# Altium project APEX.PrjPcb
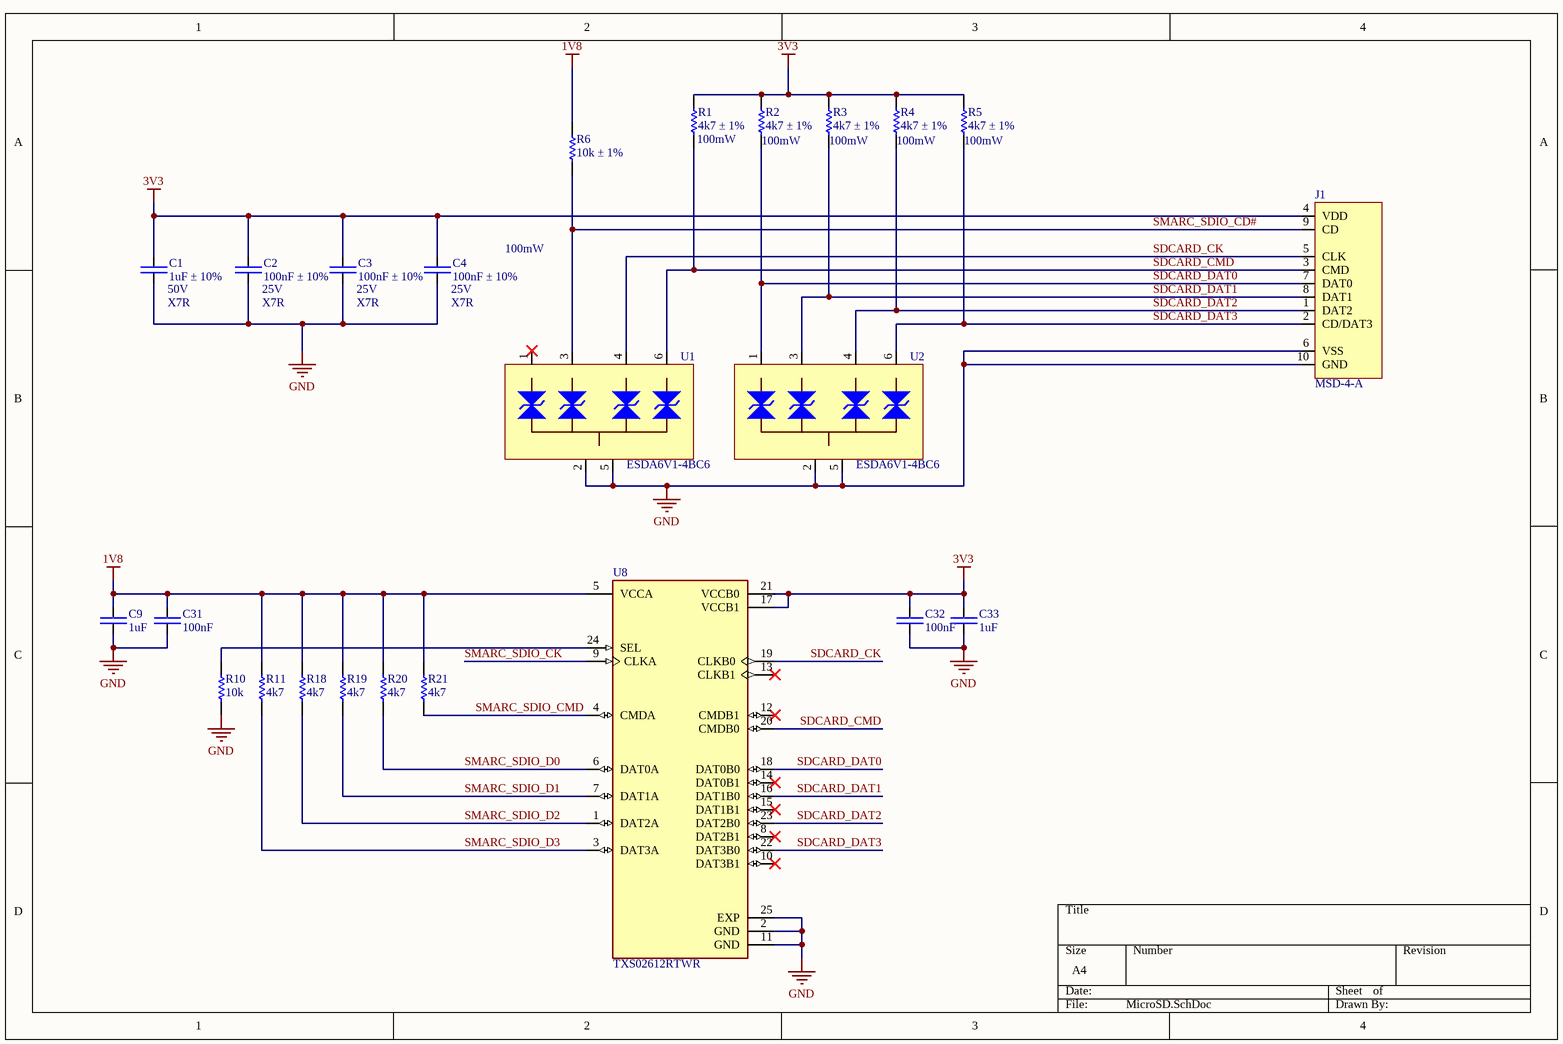
[diagram p0: MicroSD.SchDoc]
12 sheets, 103 parts. Net scope: global (net labels, ports and power ports of the same name join across sheets).
Board file: PCB.PcbDoc
Sheets:
  MicroSD.SchDoc
  Power.SchDoc
  Ethernet.SchDoc
  CAN.SchDoc
  USB.SchDoc
  Headers.SchDoc
  LEDs.SchDoc
  Display.SchDoc
  SMARC Pinout-1.SchDoc
  SMARC Pinout-2.SchDoc
  SMARC Pinout-3.SchDoc
  UART Debug.SchDoc

## Sheet MicroSD.SchDoc
size A4; SheetNumber: 1; SheetTotal: 3

### Parts
C1  1uF ± 10%  [CAP-0805]
C2  100nF ± 10%  [CAP-0603]
C3  100nF ± 10%  [CAP-0603]
C4  100nF ± 10%  [CAP-0603]
C9  1uF  [CAP-0805]
C31  100nF  [CAP-0603]
C32  100nF  [CAP-0603]
C33  1uF  [CAP-0805]
J1  MSD-4-A  [MSD-4-A]
R1  4k7 ± 1%  [RES-0603]
R2  4k7 ± 1%  [RES-0603]
R3  4k7 ± 1%  [RES-0603]
R4  4k7 ± 1%  [RES-0603]
R5  4k7 ± 1%  [RES-0603]
R6  10k ± 1%  [RES-0603]
R10  10k  [RES-0603]
R11  4k7  [RES-0603]
R18  4k7  [RES-0603]
R19  4k7  [RES-0603]
R20  4k7  [RES-0603]
R21  4k7  [RES-0603]
U1  ESDA6V1-4BC6  [ESDA6V1-4BC6]
U2  ESDA6V1-4BC6  [ESDA6V1-4BC6]
U8  TXS02612RTWR  [TXS02612RTWR]

### Nets
1V8: C9.2 C31.2 R6.2 R11.2 R18.2 R19.2 R20.2 R21.2 U8.5(VCCA)
3V3: C1.2 C2.2 C3.2 C4.2 C32.2 C33.2 J1.4(VDD) R1.2 R2.2 R3.2 R4.2 R5.2 U8.17(VCCB1) U8.21(VCCB0)
GND: C1.1 C2.1 C3.1 C4.1 C9.1 C31.1 C32.1 C33.1 J1.6(VSS) J1.10(GND) R10.1 U1.2 U1.5 U2.2 U2.5 U8.2(GND) U8.11(GND) U8.25(EXP)
SDCARD_CK: J1.5(CLK) U1.4 U8.19(CLKB0)
SDCARD_CMD: J1.3(CMD) R1.1 U1.6 U8.20(CMDB0)
SDCARD_DAT0: J1.7(DAT0) R2.1 U2.1 U8.18(DAT0B0)
SDCARD_DAT1: J1.8(DAT1) R3.1 U2.3 U8.16(DAT1B0)
SDCARD_DAT2: J1.1(DAT2) R4.1 U2.4 U8.23(DAT2B0)
SDCARD_DAT3: J1.2(CD/DAT3) R5.1 U2.6 U8.22(DAT3B0)
SMARC_SDIO_CD#: J1.9(CD) R6.1 U1.3
SMARC_SDIO_CK: U8.9(CLKA)
SMARC_SDIO_CMD: R21.1 U8.4(CMDA)
SMARC_SDIO_D0: R20.1 U8.6(DAT0A)
SMARC_SDIO_D1: R19.1 U8.7(DAT1A)
SMARC_SDIO_D2: R18.1 U8.1(DAT2A)
SMARC_SDIO_D3: R11.1 U8.3(DAT3A)
NetR10_2: R10.2 U8.24(SEL)

Not connected (* = marked no-connect by the designer): U1 1*; U8 8(DAT2B1)* 10(DAT3B1)* 12(CMDB1)* 13(CLKB1)* 14(DAT0B1)* 15(DAT1B1)*

### Notes on the sheet
- (near R1) 100mW
- (near R2) 100mW
- (near R3) 100mW
- (near R4) 100mW
- (near R5) 100mW
- 100mW
- (near C1) 50V
- (near C1) X7R
- (near C2) 25V
- (near C2) X7R
- (near C3) 25V
- (near C3) X7R
- (near C4) 25V
- (near C4) X7R

### Library data of the parts
C1 C9 C33 = CAP-0805: Capacitor chip unpolarized. 0805
C2-C4 C31 C32 = CAP-0603: Capacitor chip unpolarized. 0603
J1 = MSD-4-A: Micro SD Connector
R1-R6 R10 R11 R18-R21 = RES-0603: Resistor chip. 0603
U1 U2 = ESDA6V1-4BC6: TVS Diode array 5VRM 7.4VC
U8 = TXS02612RTWR: Voltage Level Translator 24-Pin WQFN EP T/R; MF: Texas Instruments; MP: TXS02612RTWR .; SnapEDA_Link: https://www.snapeda.com/parts/TXS02612RTWR%20./Texas+Instruments/view-part/?ref=snap; Package: None; Value: *; Check_prices: https://www.snapeda.com/parts/TXS02612RTWR%20./Texas+Instruments/view-part/?ref=eda

## Sheet Power.SchDoc
size A4; SheetNumber: 6; SheetTotal: 10
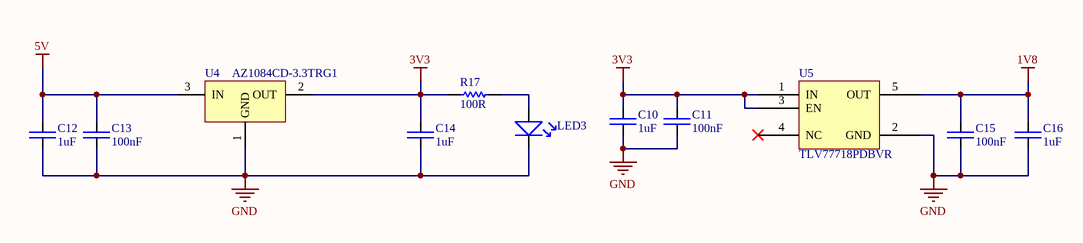
[diagram p1: Power.SchDoc]

### Parts
C10  1uF  [CAP-0805]
C11  100nF  [CAP-0603]
C12  1uF  [CAP-0805]
C13  100nF  [CAP-0603]
C14  1uF  [CAP-0805]
C15  100nF  [CAP-0603]
C16  1uF  [CAP-0805]
LED3  0603 LED  [0603 LED]  (value not drawn)
R17  100R  [RES-0603]
U4  AZ1084CD-3.3TRG1  [AZ1084CD-3.3TRG1]
U5  TLV77718PDBVR  [TLV77718PDBVR]

### Nets
1V8: C15.2 C16.2 U5.5(OUT)
3V3: C10.2 C11.2 C14.2 R17.1 U4.2(OUT) U5.1(IN) U5.3(EN)
5V: C12.2 C13.2 U4.3(IN)
GND: C10.1 C11.1 C12.1 C13.1 C14.1 C15.1 C16.1 LED3.2 U4.1(GND) U5.2(GND)
NetLED3_1: LED3.1 R17.2

Not connected (* = marked no-connect by the designer): U5 4(NC)*

### Library data of the parts
C10 C12 C14 C16 = CAP-0805: Capacitor chip unpolarized. 0805
C11 C13 C15 = CAP-0603: Capacitor chip unpolarized. 0603
R17 = RES-0603: Resistor chip. 0603
U4 = AZ1084CD-3.3TRG1: 3V3 LDO 1A 1.5V Dropout
U5 = TLV77718PDBVR: LDO 1.8V 1A

## Sheet Ethernet.SchDoc
size A4; SheetNumber: 7; SheetTotal: 12
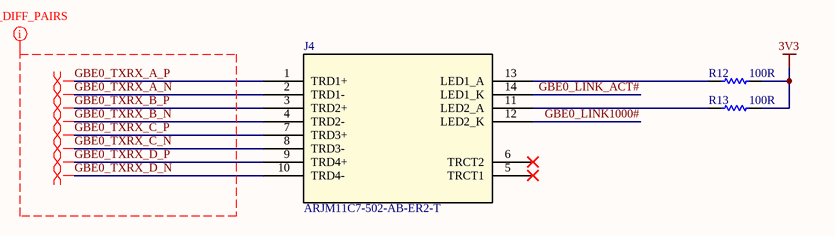
[diagram p2: Ethernet.SchDoc]

### Parts
J4  ARJM11C7-502-AB-ER2-T  [ARJM11C7-502-AB-ER2-T_ABR]
R12  100R  [RES-0603]
R13  100R  [RES-0603]

### Nets
3V3: R12.2 R13.2
GBE0_LINK1000#: J4.12(LED2_K)
GBE0_LINK_ACT#: J4.14(LED1_K)
GBE0_TXRX_A_N: J4.2(TRD1-)
GBE0_TXRX_A_P: J4.1(TRD1+)
GBE0_TXRX_B_N: J4.4(TRD2-)
GBE0_TXRX_B_P: J4.3(TRD2+)
GBE0_TXRX_C_N: J4.8(TRD3-)
GBE0_TXRX_C_P: J4.7(TRD3+)
GBE0_TXRX_D_N: J4.10(TRD4-)
GBE0_TXRX_D_P: J4.9(TRD4+)
NetJ4_11: J4.11(LED2_A) R13.1
NetJ4_13: J4.13(LED1_A) R12.1

Not connected (* = marked no-connect by the designer): J4 5(TRCT1)* 6(TRCT2)*

### Layout directives
differential pair: GBE0_TXRX_A_N, GBE0_TXRX_A_P, GBE0_TXRX_B_N, GBE0_TXRX_B_P, GBE0_TXRX_C_N, GBE0_TXRX_C_P, GBE0_TXRX_D_N, GBE0_TXRX_D_P
net class ETH_DIFF_PAIRS: GBE0_TXRX_A_N, GBE0_TXRX_A_P, GBE0_TXRX_B_N, GBE0_TXRX_B_P, GBE0_TXRX_C_N, GBE0_TXRX_C_P, GBE0_TXRX_D_N, GBE0_TXRX_D_P

### Library data of the parts
J4 = ARJM11C7-502-AB-ER2-T: Ethernet connector with magnetics (1000-T Base); Manufacturer_Name: Abracon; Copyright: Copyright (C) 2025 Ultra Librarian. All rights reserved.; Manufacturer_Part_Number: ARJM11C7-502-AB-ER2-T; RefDes: RefDes; Type: Type
R12 R13 = RES-0603: Resistor chip. 0603

## Sheet CAN.SchDoc
size A4; SheetNumber: 10; SheetTotal: 11
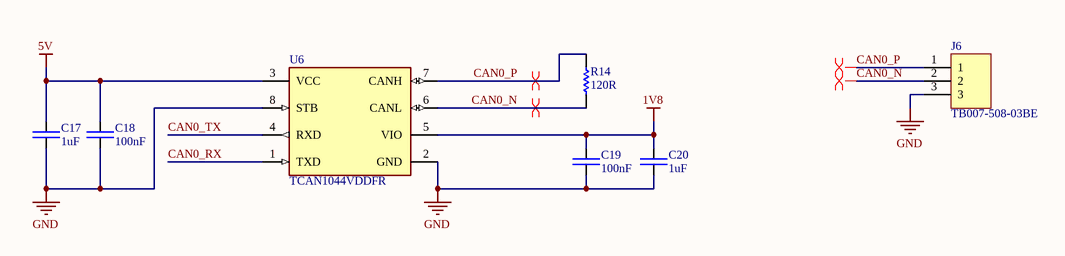
[diagram p3: CAN.SchDoc]

### Parts
C17  1uF  [CAP-0805]
C18  100nF  [CAP-0603]
C19  100nF  [CAP-0603]
C20  1uF  [CAP-0805]
J6  TB007-508-03BE  [CUI_TB007-508-03BE]
R14  120R  [RES-0603]
U6  TCAN1044VDDFR  [FP-DDF0008A-MFG]

### Nets
1V8: C19.2 C20.2 U6.5(VIO)
5V: C17.2 C18.2 U6.3(VCC)
GND: C17.1 C18.1 C19.1 C20.1 J6.3 U6.2(GND) U6.8(STB)
CAN0_N: J6.2 R14.1 U6.6(CANL)
CAN0_P: J6.1 R14.2 U6.7(CANH)
CAN0_RX: U6.1(TXD)
CAN0_TX: U6.4(RXD)

### Layout directives
differential pair: CAN0_N, CAN0_P

### Library data of the parts
C17 C20 = CAP-0805: Capacitor chip unpolarized. 0805
C18 C19 = CAP-0603: Capacitor chip unpolarized. 0603
J6 = TB007-508-03BE: 3 Pos, Screw Type, Horizontal, 5.08 Pitch, 24~12 (AWG), Terminal Block Connector; MF: Same Sky; SnapEDA_Link: https://www.snapeda.com/parts/TB007-508-03BE/Same+Sky/view-part/?ref=snap; Package: None; Value: *; MP: TB007-508-03BE; Check_prices: https://www.snapeda.com/parts/TB007-508-03BE/Same+Sky/view-part/?ref=eda
R14 = RES-0603: Resistor chip. 0603
U6 = CMP-04872-000216-1: IC TRANSCEIVER FULL 1/1 SOT23-8

## Sheet USB.SchDoc
size A4; SheetNumber: 10; SheetTotal: 12
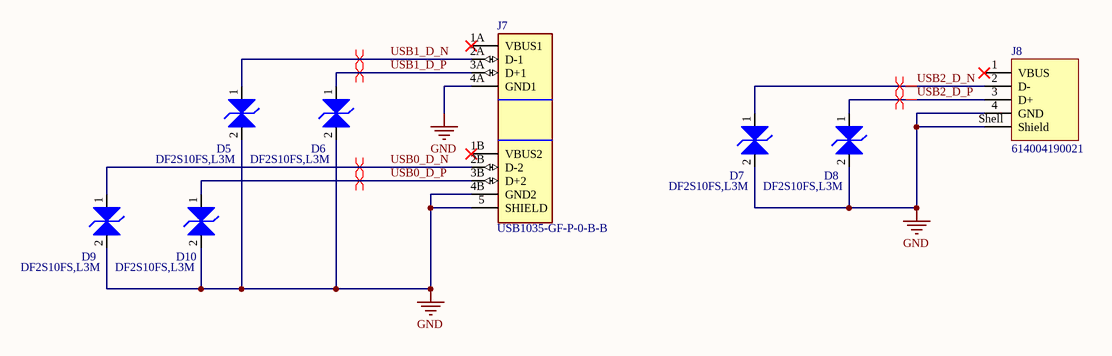
[diagram p4: USB.SchDoc]

### Parts
D5  DF2S10FS,L3M  [DF2S10FS,L3M]
D6  DF2S10FS,L3M  [DF2S10FS,L3M]
D7  DF2S10FS,L3M  [DF2S10FS,L3M]
D8  DF2S10FS,L3M  [DF2S10FS,L3M]
D9  DF2S10FS,L3M  [DF2S10FS,L3M]
D10  DF2S10FS,L3M  [DF2S10FS,L3M]
J7  USB1035-GF-P-0-B-B  [USB1035-GF-P-0-B-B]
J8  614004190021  [614004190021]

### Nets
GND: D5.2 D6.2 D7.2 D8.2 D9.2 D10.2 J7.4A(GND1) J7.4B(GND2) J7.5(SHIELD) J8.4(GND) J8.Shell(Shield)
USB0_D_N: D9.1 J7.2B(D-2)
USB0_D_P: D10.1 J7.3B(D+2)
USB1_D_N: D5.1 J7.2A(D-1)
USB1_D_P: D6.1 J7.3A(D+1)
USB2_D_N: D7.1 J8.2(D-)
USB2_D_P: D8.1 J8.3(D+)

Not connected (* = marked no-connect by the designer): J7 1A(VBUS1)* 1B(VBUS2)*; J8 1(VBUS)*

### Layout directives
differential pair: USB0_D_N, USB0_D_P, USB1_D_N, USB1_D_P, USB2_D_N, USB2_D_P

### Library data of the parts
D5-D10 = DF2S10FS,L3M: TVS Diode 8VRM
J7 = USB1035-GF-P-0-B-B: USB-A (USB TYPE-A), Stacked USB 2.0 Receptacle Connector 8 Position Through Hole, Right Angle; MF: Global Connector Technology; SnapEDA_Link: https://www.snapeda.com/parts/USB1035-GF-P-0-B-B/Global+Connector+Technology/view-part/?ref=snap; Package: None; Value: *; MP: USB1035-GF-P-0-B-B; Check_prices: https://www.snapeda.com/parts/USB1035-GF-P-0-B-B/Global+Connector+Technology/view-part/?ref=eda
J8 = CMP-1502-03228-3: USB Connector, 2.0 TYPE A, RECEPTACLE, THT; Connector Type: USB Type A; Standard: USB 2.0; Gender: Receptacle; No. of...; USB Standard: USB 2.0; Insulation Resistance: 1GΩ; Current Rating: 3A; Number of Contacts: 4; Operating Supply Voltage: 30V; Contact Resistance: 30mΩ; Housing Color: White; Contact Material: Brass; Orientation: Horizontal; Connector Type: USB; Max Operating Temperature: 85°C; Contact Plating: Gold; Number of Pins: 4; REACH SVHC: No; Insulation Material: PBT; Min Operating Temperature: -40°C; Mount: Horizontal, Through Hole; RoHS: Compliant

## Sheet Headers.SchDoc
size A4; SheetNumber: 6; SheetTotal: 12
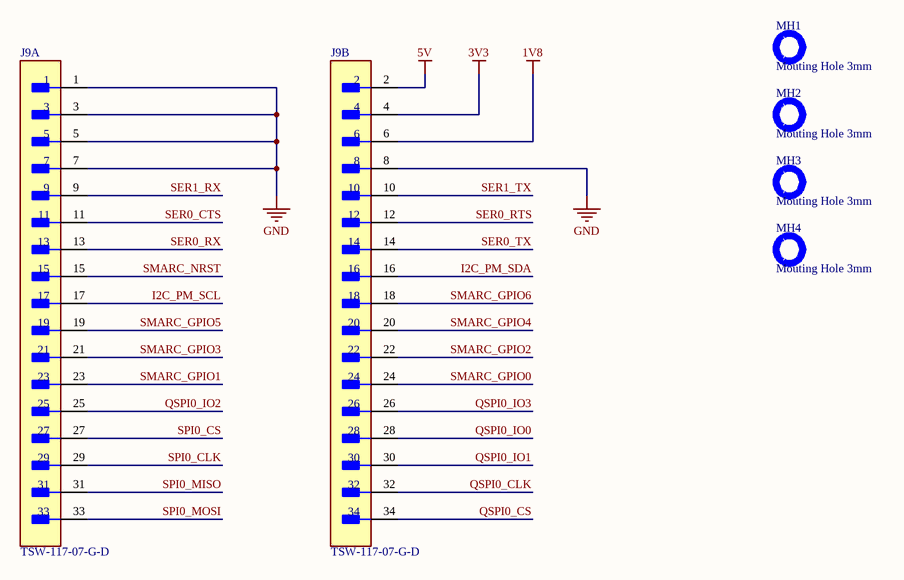
[diagram p5: Headers.SchDoc]

### Parts
J9  TSW-117-07-G-D  [FP-TSW-117-07-G-D-MFG]  (parts A,B of 2)
MH1  Mouting Hole 3mm  [MH3]
MH2  Mouting Hole 3mm  [MH3]
MH3  Mouting Hole 3mm  [MH3]
MH4  Mouting Hole 3mm  [MH3]

### Nets
1V8: J9.6
3V3: J9.4
5V: J9.2
GND: J9.1 J9.3 J9.5 J9.7 J9.8
I2C_PM_SCL: J9.17
I2C_PM_SDA: J9.16
QSPI0_CLK: J9.32
QSPI0_CS: J9.34
QSPI0_IO0: J9.28
QSPI0_IO1: J9.30
QSPI0_IO2: J9.25
QSPI0_IO3: J9.26
SER0_CTS: J9.11
SER0_RTS: J9.12
SER0_RX: J9.13
SER0_TX: J9.14
SER1_RX: J9.9
SER1_TX: J9.10
SMARC_GPIO0: J9.24
SMARC_GPIO1: J9.23
SMARC_GPIO2: J9.22
SMARC_GPIO3: J9.21
SMARC_GPIO4: J9.20
SMARC_GPIO5: J9.19
SMARC_GPIO6: J9.18
SMARC_NRST: J9.15
SPI0_CLK: J9.29
SPI0_CS: J9.27
SPI0_MISO: J9.31
SPI0_MOSI: J9.33

### Library data of the parts
J9 = CMP-02766-000015-1: CONN HEADER VERT 34POS 2.54MM; Manufacturer: Samtec; Current Rating: 6.3A; Voltage Rating: 550V; Conn Orientation: Vertical; Conn Gender: Male; Number Of Contacts: 34; RoHS: TRUE; Temperature Range High: +125°C; Digikey Description: CONN HEADER VERT 34POS 2.54MM; Manufacturer Part Number: TSW-117-07-G-D; ComponentLink2Description: Datasheet; Device Class L1: Connectors; Automotive: No; Height: 8.71mm; Device Class L3: unset; Lead Free: No; Number Of Rows: 2; Temperature: -55°C to +125°C; Pitch: 2.54mm; Octopart: https://octopart.com/tsw-117-07-g-d-samtec-272162; ComponentLink2URL: http://suddendocs.samtec.com/prints/tsw-xxx-xx-xxx-x-xx-xxx-mkt.pdf; Temperature Range Low: -55°C; Footprint Url: http://suddendocs.samtec.com/prints/tsw-xxx-xx-x-x-xx-xxx-footprint.pdf; Device Class L2: Headers and Wire Housings; Package: TSW-117-07-G-D; Contact Material: Gold,Nickel; Category: Conn
MH1-MH4 = MH3

## Sheet LEDs.SchDoc
size A4; SheetNumber: 12; SheetTotal: 12
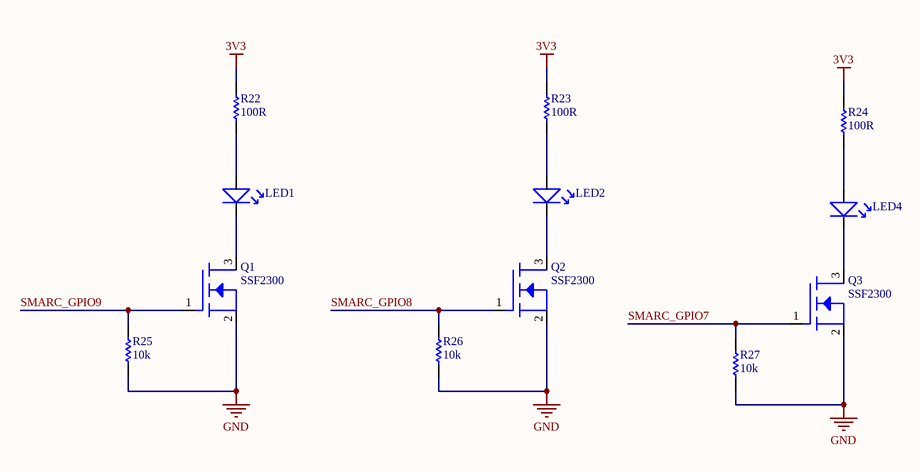
[diagram p6: LEDs.SchDoc]

### Parts
LED1  0603 LED  [0603 LED]  (value not drawn)
LED2  0603 LED  [0603 LED]  (value not drawn)
LED4  0603 LED  [0603 LED]  (value not drawn)
Q1  SSF2300  [SSF2300]
Q2  SSF2300  [SSF2300]
Q3  SSF2300  [SSF2300]
R22  100R  [RES-0603]
R23  100R  [RES-0603]
R24  100R  [RES-0603]
R25  10k  [RES-0603]
R26  10k  [RES-0603]
R27  10k  [RES-0603]

### Nets
3V3: R22.2 R23.2 R24.2
GND: Q1.2 Q2.2 Q3.2 R25.1 R26.1 R27.1
SMARC_GPIO7: Q3.1 R27.2
SMARC_GPIO8: Q2.1 R26.2
SMARC_GPIO9: Q1.1 R25.2
NetLED1_1: LED1.1 R22.1
NetLED1_2: LED1.2 Q1.3
NetLED2_1: LED2.1 R23.1
NetLED2_2: LED2.2 Q2.3
NetLED4_1: LED4.1 R24.1
NetLED4_2: LED4.2 Q3.3

### Library data of the parts
Q1-Q3 = SSF2300: NMOS 20V 4.5A SOT23
R22-R27 = RES-0603: Resistor chip. 0603

## Sheet Display.SchDoc
size A4; SheetNumber: 8; SheetTotal: 12
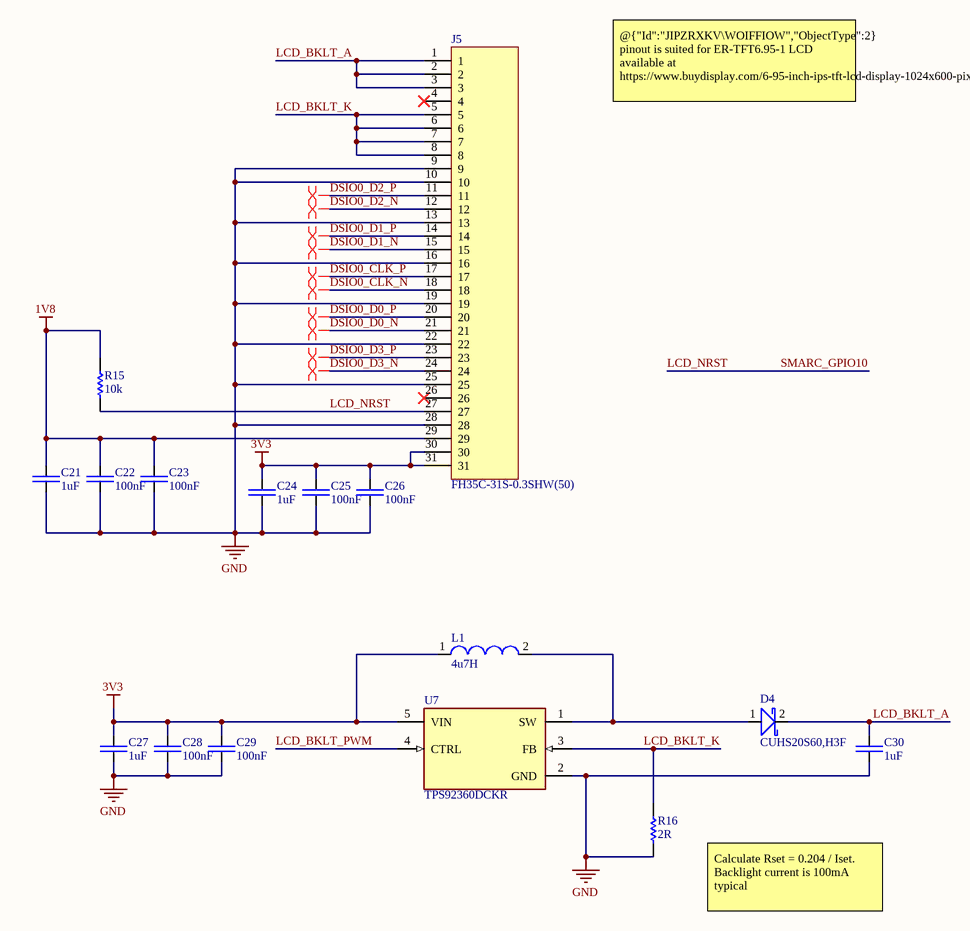
[diagram p7: Display.SchDoc]

### Parts
C21  1uF  [CAP-0805]
C22  100nF  [CAP-0603]
C23  100nF  [CAP-0603]
C24  1uF  [CAP-0805]
C25  100nF  [CAP-0603]
C26  100nF  [CAP-0603]
C27  1uF  [CAP-0805]
C28  100nF  [CAP-0603]
C29  100nF  [CAP-0603]
C30  1uF  [CAP-0805]
D4  CUHS20S60,H3F  [CUHS20S60,H3F]
J5  FH35C-31S-0.3SHW(50)  [HRS_FH35C-31S-0.3SHW(50)]
L1  4u7H  [IND-1210]
R15  10k  [RES-0603]
R16  2R  [RES-0603]
U7  TPS92360DCKR  [FP-DCK0005A-IPC_C]

### Nets
1V8: C21.2 C22.2 C23.2 J5.29 R15.2
3V3: C24.2 C25.2 C26.2 C27.2 C28.2 C29.2 J5.30 J5.31 L1.1 U7.5(VIN)
GND: C21.1 C22.1 C23.1 C24.1 C25.1 C26.1 C27.1 C28.1 C29.1 C30.1 J5.9 J5.10 J5.13 J5.16 J5.19 J5.22 J5.25 J5.28 R16.1 U7.2(GND)
DSIO0_CLK_N: J5.18
DSIO0_CLK_P: J5.17
DSIO0_D0_N: J5.21
DSIO0_D0_P: J5.20
DSIO0_D1_N: J5.15
DSIO0_D1_P: J5.14
DSIO0_D2_N: J5.12
DSIO0_D2_P: J5.11
DSIO0_D3_N: J5.24
DSIO0_D3_P: J5.23
LCD_BKLT_A: C30.2 D4.2 J5.1 J5.2 J5.3
LCD_BKLT_K: J5.5 J5.6 J5.7 J5.8 R16.2 U7.3(FB)
LCD_BKLT_PWM: U7.4(CTRL)
LCD_NRST: J5.27 R15.1  [also labelled SMARC_GPIO10]
NetD4_1: D4.1 L1.2 U7.1(SW)

Not connected (* = marked no-connect by the designer): J5 4* 26*

### Layout directives
differential pair: DSIO0_CLK_N, DSIO0_CLK_P, DSIO0_D0_N, DSIO0_D0_P, DSIO0_D1_N, DSIO0_D1_P, DSIO0_D2_N, DSIO0_D2_P, DSIO0_D3_N, DSIO0_D3_P

### Notes on the sheet
- @{"Id":"JIPZRXKV\WOIFFIOW","ObjectType":2} pinout is suited for ER-TFT6.95-1 LCD available at https://www.buydisplay.com/6-95-inch-ips-tft-lcd-display-1024x600-pixels-with-mipi-interface
- Calculate Rset = 0.204 / Iset. Backlight current is 100mA typical

### Library data of the parts
C21 C24 C27 C30 = CAP-0805: Capacitor chip unpolarized. 0805
C22 C23 C25 C26 C28 C29 = CAP-0603: Capacitor chip unpolarized. 0603
D4 = CUHS20S60,H3F: Diode Schottky 2A 0.5V
J5 = FH35C-31S-0.3SHW(50): 31 Position FPC Connector Contacts, Top and Bottom 0.012 (0.30mm) Surface Mount, Right Angle; MF: Hirose Electric; SnapEDA_Link: https://www.snapeda.com/parts/FH35C-31S-0.3SHW(50)/Hirose/view-part/?ref=snap; Package: None; Value: *; MP: FH35C-31S-0.3SHW(50); Check_prices: https://www.snapeda.com/parts/FH35C-31S-0.3SHW(50)/Hirose/view-part/?ref=eda
L1 = IND-1210
R15 R16 = RES-0603: Resistor chip. 0603
U7 = CMP-04914-000056-1: 38-V 1.2-A single channel LED backlight driver 5-SC70 -40 to 85

## Sheet SMARC Pinout-1.SchDoc
size A4; SheetNumber: 3; SheetTotal: 10
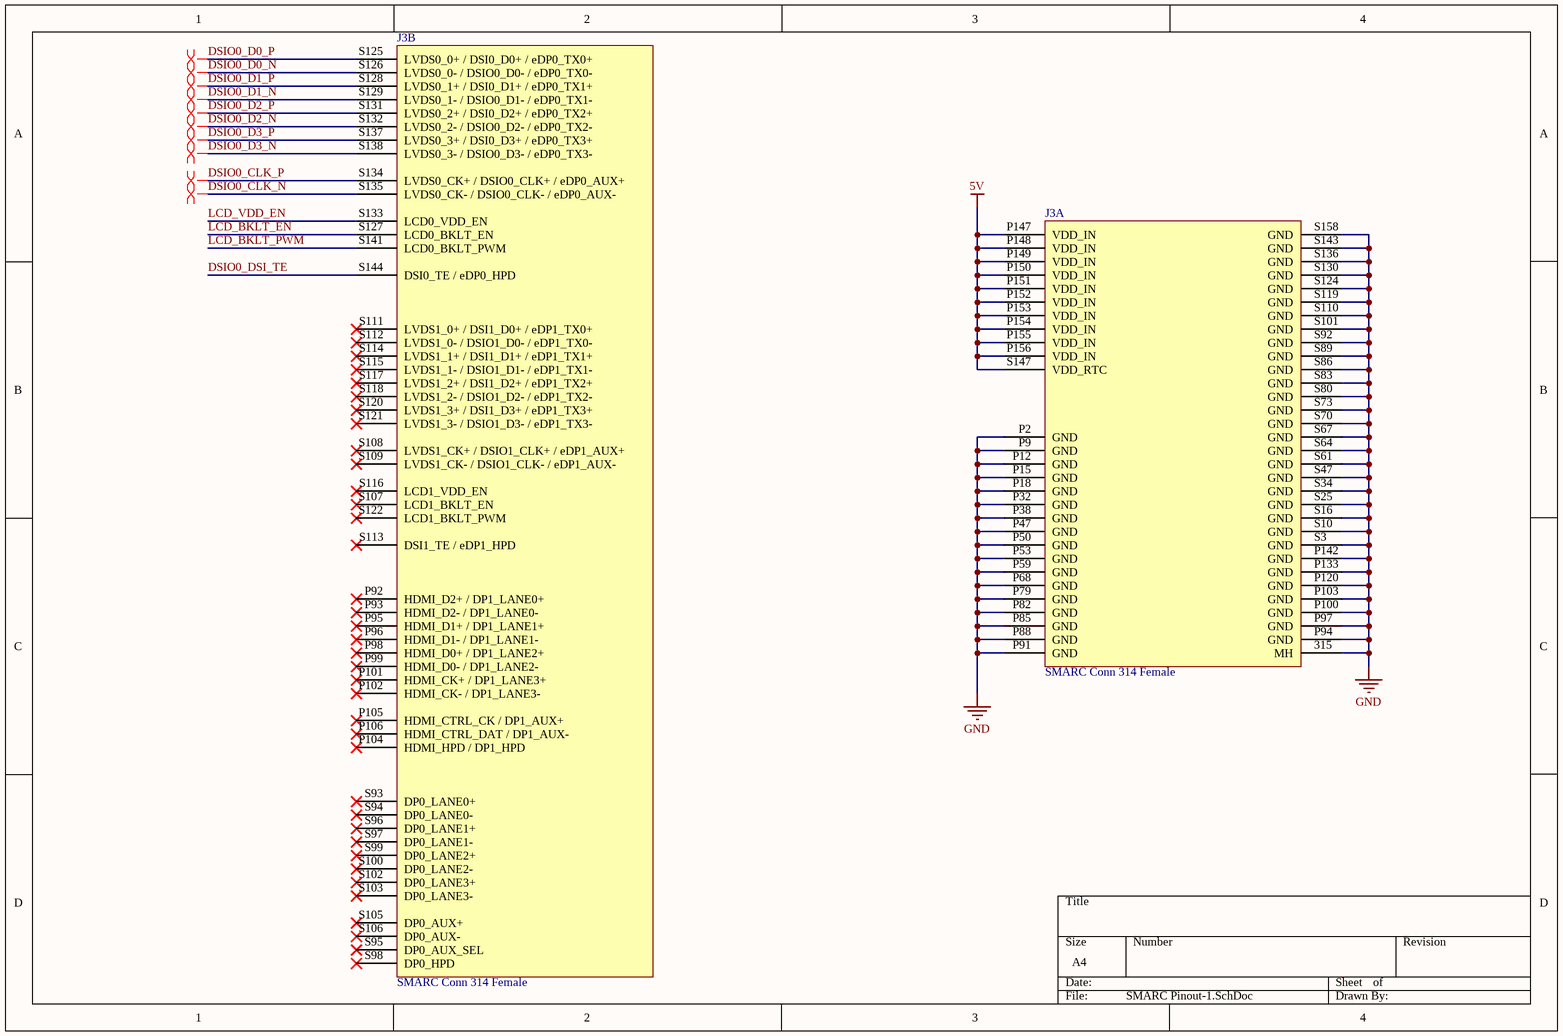
[diagram p8: SMARC Pinout-1.SchDoc]

### Parts
J3  SMARC Conn 314 Female  [SMARC 314 Female]  (parts A,B of 6)

### Nets
5V: J3.P147(VDD_IN) J3.P148(VDD_IN) J3.P149(VDD_IN) J3.P150(VDD_IN) J3.P151(VDD_IN) J3.P152(VDD_IN) J3.P153(VDD_IN) J3.P154(VDD_IN) J3.P155(VDD_IN) J3.P156(VDD_IN) J3.S147(VDD_RTC)
GND: J3.315(MH) J3.P2(GND) J3.P9(GND) J3.P12(GND) J3.P15(GND) J3.P18(GND) J3.P32(GND) J3.P38(GND) J3.P47(GND) J3.P50(GND) J3.P53(GND) J3.P59(GND) J3.P68(GND) J3.P79(GND) J3.P82(GND) J3.P85(GND) J3.P88(GND) J3.P91(GND) J3.P94(GND) J3.P97(GND) J3.P100(GND) J3.P103(GND) J3.P120(GND) J3.P133(GND) J3.P142(GND) J3.S3(GND) J3.S10(GND) J3.S16(GND) J3.S25(GND) J3.S34(GND) J3.S47(GND) J3.S61(GND) J3.S64(GND) J3.S67(GND) J3.S70(GND) J3.S73(GND) J3.S80(GND) J3.S83(GND) J3.S86(GND) J3.S89(GND) J3.S92(GND) J3.S101(GND) J3.S110(GND) J3.S119(GND) J3.S124(GND) J3.S130(GND) J3.S136(GND) J3.S143(GND) J3.S158(GND)
DSIO0_CLK_N: J3.S135(LVDS0_CK-_/_DSIO0_CLK-_/_eDP0_AUX-)
DSIO0_CLK_P: J3.S134(LVDS0_CK+_/_DSIO0_CLK+_/_eDP0_AUX+)
DSIO0_D0_N: J3.S126(LVDS0_0-_/_DSIO0_D0-_/_eDP0_TX0-)
DSIO0_D0_P: J3.S125(LVDS0_0+_/_DSI0_D0+_/_eDP0_TX0+)
DSIO0_D1_N: J3.S129(LVDS0_1-_/_DSIO0_D1-_/_eDP0_TX1-)
DSIO0_D1_P: J3.S128(LVDS0_1+_/_DSI0_D1+_/_eDP0_TX1+)
DSIO0_D2_N: J3.S132(LVDS0_2-_/_DSIO0_D2-_/_eDP0_TX2-)
DSIO0_D2_P: J3.S131(LVDS0_2+_/_DSI0_D2+_/_eDP0_TX2+)
DSIO0_D3_N: J3.S138(LVDS0_3-_/_DSIO0_D3-_/_eDP0_TX3-)
DSIO0_D3_P: J3.S137(LVDS0_3+_/_DSI0_D3+_/_eDP0_TX3+)
DSIO0_DSI_TE: J3.S144(DSI0_TE_/_eDP0_HPD)
LCD_BKLT_EN: J3.S127(LCD0_BKLT_EN)
LCD_BKLT_PWM: J3.S141(LCD0_BKLT_PWM)
LCD_VDD_EN: J3.S133(LCD0_VDD_EN)

Not connected (* = marked no-connect by the designer): J3 P92(HDMI_D2+_/_DP1_LANE0+)* P93(HDMI_D2-_/_DP1_LANE0-)* P95(HDMI_D1+_/_DP1_LANE1+)* P96(HDMI_D1-_/_DP1_LANE1-)* P98(HDMI_D0+_/_DP1_LANE2+)* P99(HDMI_D0-_/_DP1_LANE2-)* P101(HDMI_CK+_/_DP1_LANE3+)* P102(HDMI_CK-_/_DP1_LANE3-)* P104(HDMI_HPD_/_DP1_HPD)* P105(HDMI_CTRL_CK_/_DP1_AUX+)* P106(HDMI_CTRL_DAT_/_DP1_AUX-)* S93(DP0_LANE0+)* S94(DP0_LANE0-)* S95(DP0_AUX_SEL)* S96(DP0_LANE1+)* S97(DP0_LANE1-)* S98(DP0_HPD)* S99(DP0_LANE2+)* S100(DP0_LANE2-)* S102(DP0_LANE3+)* S103(DP0_LANE3-)* S105(DP0_AUX+)* S106(DP0_AUX-)* S107(LCD1_BKLT_EN)* S108(LVDS1_CK+_/_DSIO1_CLK+_/_eDP1_AUX+)* S109(LVDS1_CK-_/_DSIO1_CLK-_/_eDP1_AUX-)* S111(LVDS1_0+_/_DSI1_D0+_/_eDP1_TX0+)* S112(LVDS1_0-_/_DSIO1_D0-_/_eDP1_TX0-)* S113(DSI1_TE_/_eDP1_HPD)* S114(LVDS1_1+_/_DSI1_D1+_/_eDP1_TX1+)* S115(LVDS1_1-_/_DSIO1_D1-_/_eDP1_TX1-)* S116(LCD1_VDD_EN)* S117(LVDS1_2+_/_DSI1_D2+_/_eDP1_TX2+)* S118(LVDS1_2-_/_DSIO1_D2-_/_eDP1_TX2-)* S120(LVDS1_3+_/_DSI1_D3+_/_eDP1_TX3+)* S121(LVDS1_3-_/_DSIO1_D3-_/_eDP1_TX3-)* S122(LCD1_BKLT_PWM)*

### Layout directives
differential pair: DSIO0_CLK_N, DSIO0_CLK_P, DSIO0_D0_N, DSIO0_D0_P, DSIO0_D1_N, DSIO0_D1_P, DSIO0_D2_N, DSIO0_D2_P, DSIO0_D3_N, DSIO0_D3_P

## Sheet SMARC Pinout-2.SchDoc
size A4; SheetNumber: 4; SheetTotal: 11
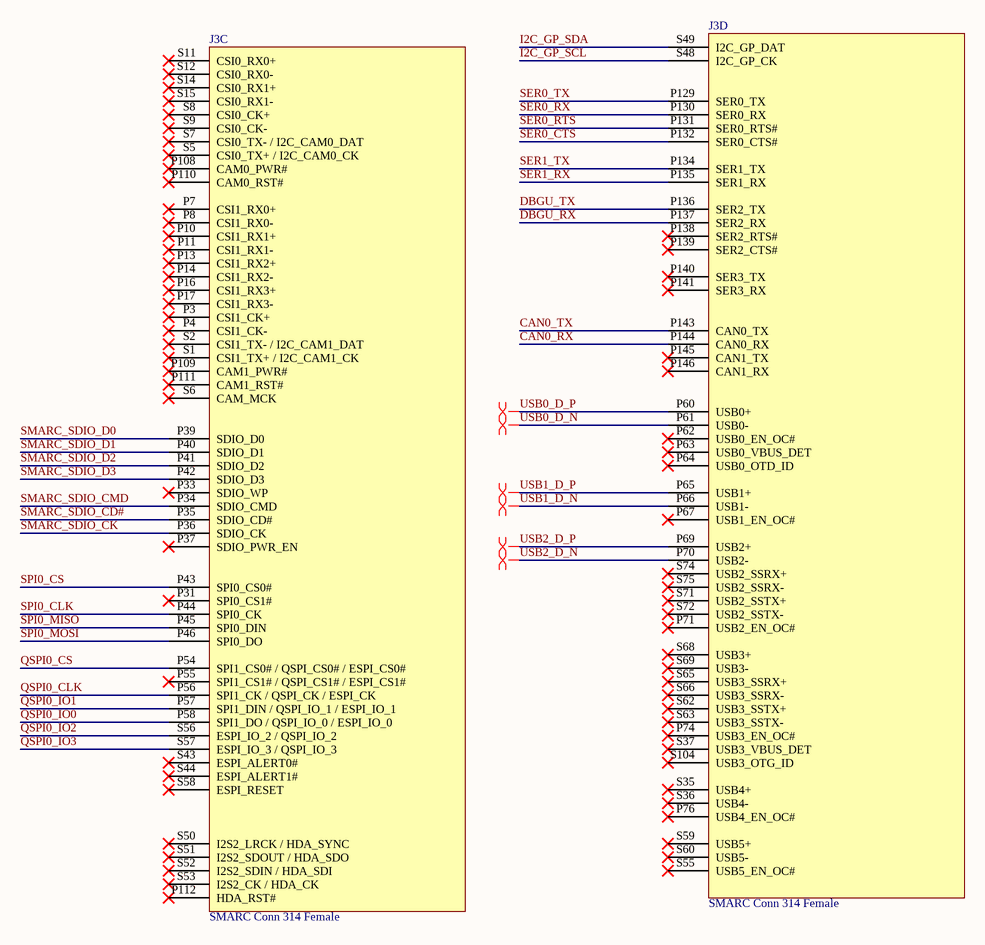
[diagram p9: SMARC Pinout-2.SchDoc]

### Parts
J3  SMARC Conn 314 Female  [SMARC 314 Female]  (parts C,D of 6)

### Nets
CAN0_RX: J3.P144(CAN0_RX)
CAN0_TX: J3.P143(CAN0_TX)
DBGU_RX: J3.P137(SER2_RX)
DBGU_TX: J3.P136(SER2_TX)
I2C_GP_SCL: J3.S48(I2C_GP_CK)
I2C_GP_SDA: J3.S49(I2C_GP_DAT)
QSPI0_CLK: J3.P56(SPI1_CK_/_QSPI_CK_/_ESPI_CK)
QSPI0_CS: J3.P54(SPI1_CS0#_/_QSPI_CS0#_/_ESPI_CS0#)
QSPI0_IO0: J3.P58(SPI1_DO_/_QSPI_IO_0_/_ESPI_IO_0)
QSPI0_IO1: J3.P57(SPI1_DIN_/_QSPI_IO_1_/_ESPI_IO_1)
QSPI0_IO2: J3.S56(ESPI_IO_2_/_QSPI_IO_2)
QSPI0_IO3: J3.S57(ESPI_IO_3_/_QSPI_IO_3)
SER0_CTS: J3.P132(SER0_CTS#)
SER0_RTS: J3.P131(SER0_RTS#)
SER0_RX: J3.P130(SER0_RX)
SER0_TX: J3.P129(SER0_TX)
SER1_RX: J3.P135(SER1_RX)
SER1_TX: J3.P134(SER1_TX)
SMARC_GPIO0: J3.P108(CAM0_PWR#)
SMARC_GPIO1: J3.P109(CAM1_PWR#)
SMARC_GPIO2: J3.P110(CAM0_RST#)
SMARC_GPIO3: J3.P111(CAM1_RST#)
SMARC_GPIO4: J3.P112(HDA_RST#)
SMARC_SDIO_CD#: J3.P35(SDIO_CD#)
SMARC_SDIO_CK: J3.P36(SDIO_CK)
SMARC_SDIO_CMD: J3.P34(SDIO_CMD)
SMARC_SDIO_D0: J3.P39(SDIO_D0)
SMARC_SDIO_D1: J3.P40(SDIO_D1)
SMARC_SDIO_D2: J3.P41(SDIO_D2)
SMARC_SDIO_D3: J3.P42(SDIO_D3)
SPI0_CLK: J3.P44(SPI0_CK)
SPI0_CS: J3.P43(SPI0_CS0#)
SPI0_MISO: J3.P45(SPI0_DIN)
SPI0_MOSI: J3.P46(SPI0_DO)
USB0_D_N: J3.P61(USB0-)
USB0_D_P: J3.P60(USB0+)
USB1_D_N: J3.P66(USB1-)
USB1_D_P: J3.P65(USB1+)
USB2_D_N: J3.P70(USB2-)
USB2_D_P: J3.P69(USB2+)

Not connected (* = marked no-connect by the designer): J3 P3(CSI1_CK+)* P4(CSI1_CK-)* P7(CSI1_RX0+)* P8(CSI1_RX0-)* P10(CSI1_RX1+)* P11(CSI1_RX1-)* P13(CSI1_RX2+)* P14(CSI1_RX2-)* P16(CSI1_RX3+)* P17(CSI1_RX3-)* P31(SPI0_CS1#)* P33(SDIO_WP)* P37(SDIO_PWR_EN)* P55(SPI1_CS1#_/_QSPI_CS1#_/_ESPI_CS1#)* P62(USB0_EN_OC#)* P63(USB0_VBUS_DET)* P64(USB0_OTD_ID)* P67(USB1_EN_OC#)* P71(USB2_EN_OC#)* P74(USB3_EN_OC#)* P76(USB4_EN_OC#)* P138(SER2_RTS#)* P139(SER2_CTS#)* P140(SER3_TX)* P141(SER3_RX)* P145(CAN1_TX)* P146(CAN1_RX)* S1(CSI1_TX+_/_I2C_CAM1_CK)* S2(CSI1_TX-_/_I2C_CAM1_DAT)* S5(CSI0_TX+_/_I2C_CAM0_CK)* S6(CAM_MCK)* S7(CSI0_TX-_/_I2C_CAM0_DAT)* S8(CSI0_CK+)* S9(CSI0_CK-)* S11(CSI0_RX0+)* S12(CSI0_RX0-)* S14(CSI0_RX1+)* S15(CSI0_RX1-)* S35(USB4+)* S36(USB4-)* S37(USB3_VBUS_DET)* S43(ESPI_ALERT0#)* S44(ESPI_ALERT1#)* S50(I2S2_LRCK_/_HDA_SYNC)* S51(I2S2_SDOUT_/_HDA_SDO)* S52(I2S2_SDIN_/_HDA_SDI)* S53(I2S2_CK_/_HDA_CK)* S55(USB5_EN_OC#)* S58(ESPI_RESET)* S59(USB5+)* S60(USB5-)* S62(USB3_SSTX+)* S63(USB3_SSTX-)* S65(USB3_SSRX+)* S66(USB3_SSRX-)* S68(USB3+)* S69(USB3-)* S71(USB2_SSTX+)* S72(USB2_SSTX-)* S74(USB2_SSRX+)* S75(USB2_SSRX-)* S104(USB3_OTG_ID)*

### Layout directives
differential pair: USB0_D_N, USB0_D_P, USB1_D_N, USB1_D_P, USB2_D_N, USB2_D_P

## Sheet SMARC Pinout-3.SchDoc
size A4; SheetNumber: 5; SheetTotal: 8
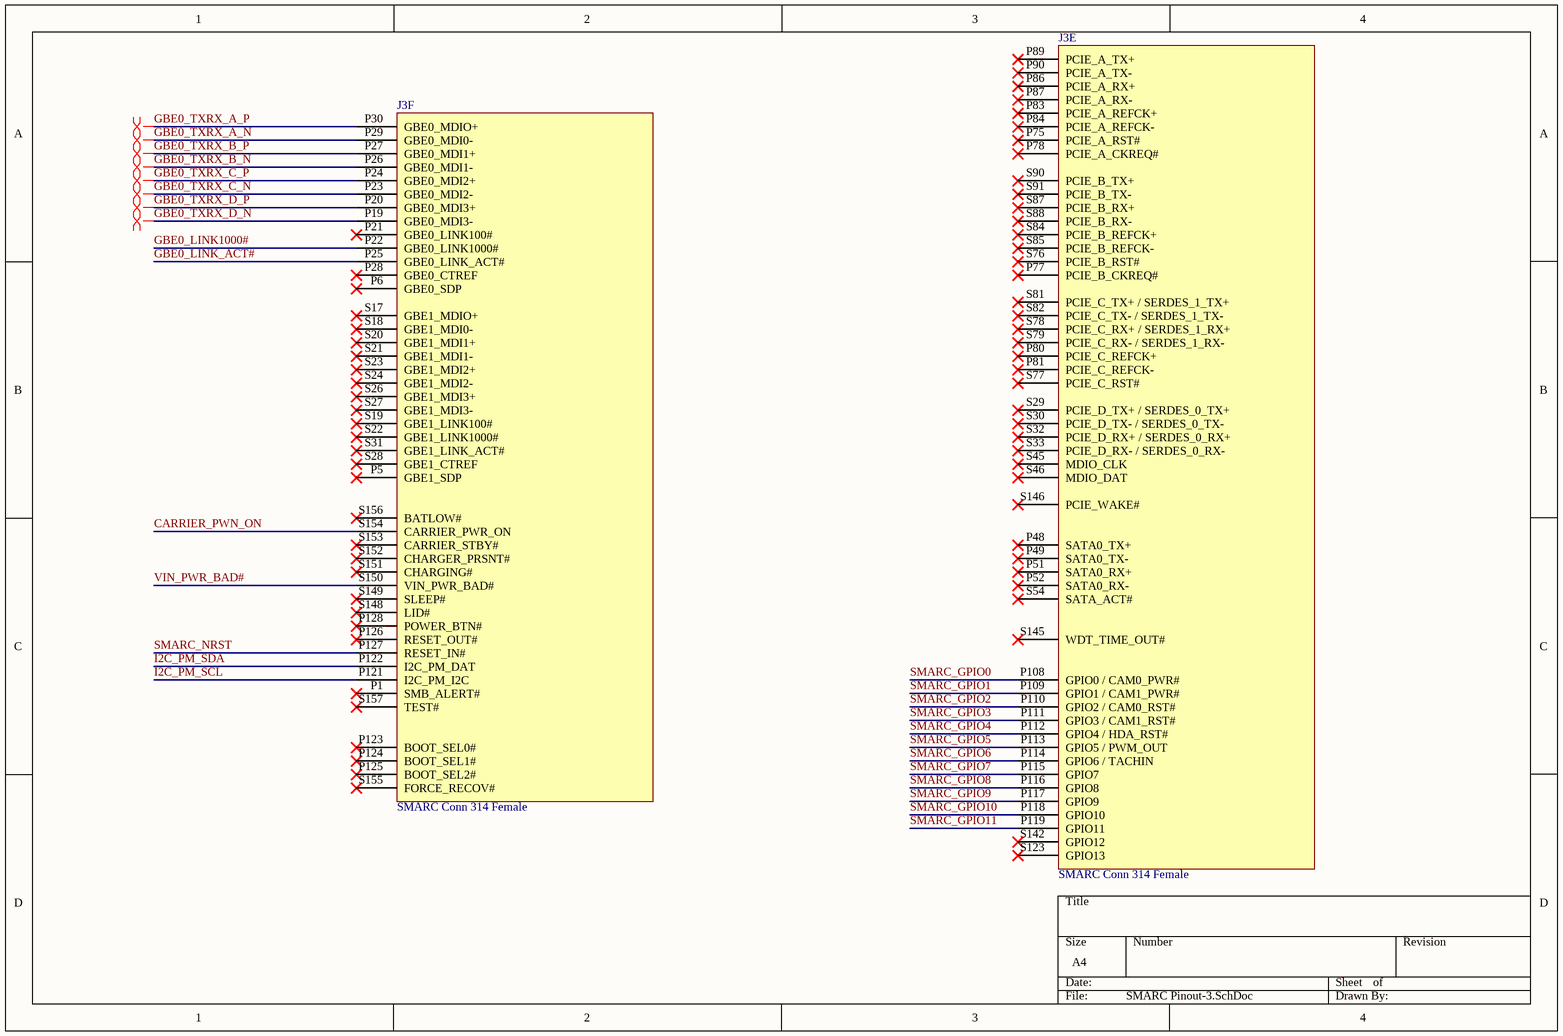
[diagram p10: SMARC Pinout-3.SchDoc]

### Parts
J3  SMARC Conn 314 Female  [SMARC 314 Female]  (parts E,F of 6)

### Nets
CARRIER_PWN_ON: J3.S154(CARRIER_PWR_ON)
GBE0_LINK1000#: J3.P22(GBE0_LINK1000#)
GBE0_LINK_ACT#: J3.P25(GBE0_LINK_ACT#)
GBE0_TXRX_A_N: J3.P29(GBE0_MDI0-)
GBE0_TXRX_A_P: J3.P30(GBE0_MDIO+)
GBE0_TXRX_B_N: J3.P26(GBE0_MDI1-)
GBE0_TXRX_B_P: J3.P27(GBE0_MDI1+)
GBE0_TXRX_C_N: J3.P23(GBE0_MDI2-)
GBE0_TXRX_C_P: J3.P24(GBE0_MDI2+)
GBE0_TXRX_D_N: J3.P19(GBE0_MDI3-)
GBE0_TXRX_D_P: J3.P20(GBE0_MDI3+)
I2C_PM_SCL: J3.P121(I2C_PM_I2C)
I2C_PM_SDA: J3.P122(I2C_PM_DAT)
SMARC_GPIO0: J3.P108(GPIO0_/_CAM0_PWR#)
SMARC_GPIO1: J3.P109(GPIO1_/_CAM1_PWR#)
SMARC_GPIO2: J3.P110(GPIO2_/_CAM0_RST#)
SMARC_GPIO3: J3.P111(GPIO3_/_CAM1_RST#)
SMARC_GPIO4: J3.P112(GPIO4_/_HDA_RST#)
SMARC_GPIO5: J3.P113(GPIO5_/_PWM_OUT)
SMARC_GPIO6: J3.P114(GPIO6_/_TACHIN)
SMARC_GPIO7: J3.P115(GPIO7)
SMARC_GPIO8: J3.P116(GPIO8)
SMARC_GPIO9: J3.P117(GPIO9)
SMARC_GPIO10: J3.P118(GPIO10)  [project net LCD_NRST]
SMARC_GPIO11: J3.P119(GPIO11)
SMARC_NRST: J3.P127(RESET_IN#)
VIN_PWR_BAD#: J3.S150(VIN_PWR_BAD#)

Not connected (* = marked no-connect by the designer): J3 P1(SMB_ALERT#)* P5(GBE1_SDP)* P6(GBE0_SDP)* P21(GBE0_LINK100#)* P28(GBE0_CTREF)* P48(SATA0_TX+)* P49(SATA0_TX-)* P51(SATA0_RX+)* P52(SATA0_RX-)* P75(PCIE_A_RST#)* P77(PCIE_B_CKREQ#)* P78(PCIE_A_CKREQ#)* P80(PCIE_C_REFCK+)* P81(PCIE_C_REFCK-)* P83(PCIE_A_REFCK+)* P84(PCIE_A_REFCK-)* P86(PCIE_A_RX+)* P87(PCIE_A_RX-)* P89(PCIE_A_TX+)* P90(PCIE_A_TX-)* P123(BOOT_SEL0#)* P124(BOOT_SEL1#)* P125(BOOT_SEL2#)* P126(RESET_OUT#)* P128(POWER_BTN#)* S17(GBE1_MDIO+)* S18(GBE1_MDI0-)* S19(GBE1_LINK100#)* S20(GBE1_MDI1+)* S21(GBE1_MDI1-)* S22(GBE1_LINK1000#)* S23(GBE1_MDI2+)* S24(GBE1_MDI2-)* S26(GBE1_MDI3+)* S27(GBE1_MDI3-)* S28(GBE1_CTREF)* S29(PCIE_D_TX+_/_SERDES_0_TX+)* S30(PCIE_D_TX-_/_SERDES_0_TX-)* S31(GBE1_LINK_ACT#)* S32(PCIE_D_RX+_/_SERDES_0_RX+)* S33(PCIE_D_RX-_/_SERDES_0_RX-)* S45(MDIO_CLK)* S46(MDIO_DAT)* S54(SATA_ACT#)* S76(PCIE_B_RST#)* S77(PCIE_C_RST#)* S78(PCIE_C_RX+_/_SERDES_1_RX+)* S79(PCIE_C_RX-_/_SERDES_1_RX-)* S81(PCIE_C_TX+_/_SERDES_1_TX+)* S82(PCIE_C_TX-_/_SERDES_1_TX-)* S84(PCIE_B_REFCK+)* S85(PCIE_B_REFCK-)* S87(PCIE_B_RX+)* S88(PCIE_B_RX-)* S90(PCIE_B_TX+)* S91(PCIE_B_TX-)* S123(GPIO13)* S142(GPIO12)* S145(WDT_TIME_OUT#)* S146(PCIE_WAKE#)* S148(LID#)* S149(SLEEP#)* S151(CHARGING#)* S152(CHARGER_PRSNT#)* S153(CARRIER_STBY#)* S155(FORCE_RECOV#)* S156(BATLOW#)* S157(TEST#)*

### Layout directives
differential pair: GBE0_TXRX_A_N, GBE0_TXRX_A_P, GBE0_TXRX_B_N, GBE0_TXRX_B_P, GBE0_TXRX_C_N, GBE0_TXRX_C_P, GBE0_TXRX_D_N, GBE0_TXRX_D_P

## Sheet UART Debug.SchDoc
size A4; SheetNumber: 2; SheetTotal: 12
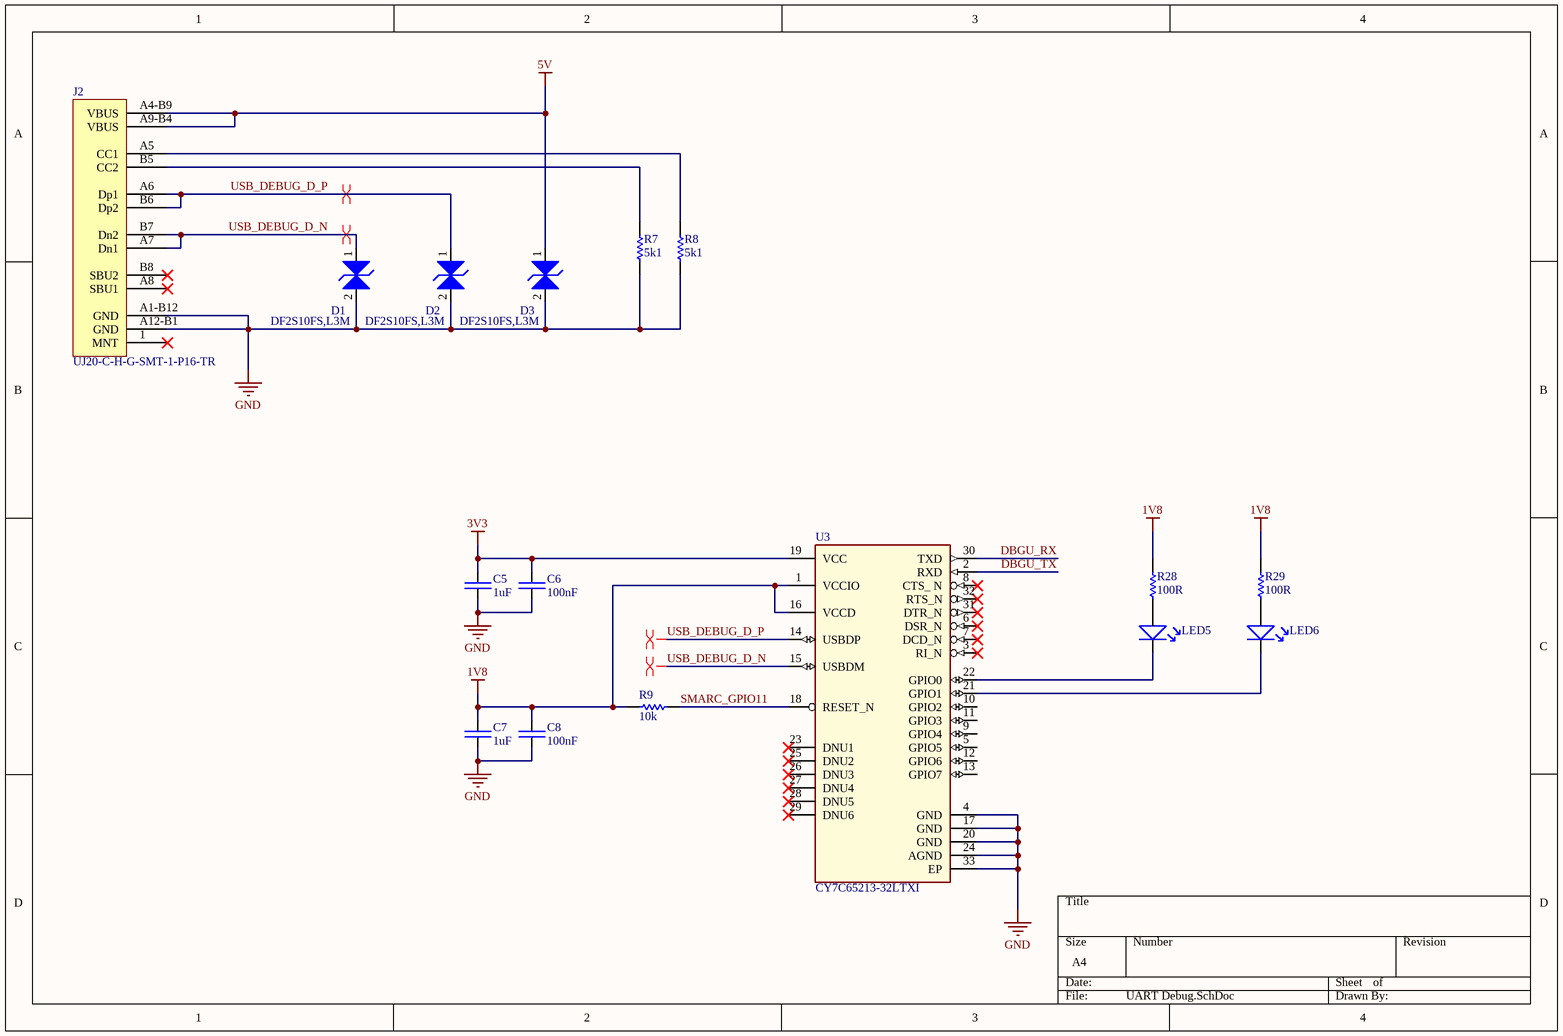
[diagram p11: UART Debug.SchDoc]

### Parts
C5  1uF  [CAP-0805]
C6  100nF  [CAP-0603]
C7  1uF  [CAP-0805]
C8  100nF  [CAP-0603]
D1  DF2S10FS,L3M  [DF2S10FS,L3M]
D2  DF2S10FS,L3M  [DF2S10FS,L3M]
D3  DF2S10FS,L3M  [DF2S10FS,L3M]
J2  UJ20-C-H-G-SMT-1-P16-TR  [UJ20-C-H-G-SMT-1-P16-TR]
LED5  0603 LED  [0603 LED]  (value not drawn)
LED6  0603 LED  [0603 LED]  (value not drawn)
R7  5k1  [RES-0603]
R8  5k1  [RES-0603]
R9  10k  [RES-0603]
R28  100R  [RES-0603]
R29  100R  [RES-0603]
U3  CY7C65213-32LTXI  [CY7C65213-32LTXI]

### Nets
1V8: C7.2 C8.2 R9.1 R28.2 R29.2 U3.1(VCCIO) U3.16(VCCD)
3V3: C5.2 C6.2 U3.19(VCC)
5V: D3.1 J2.A4-B9(VBUS) J2.A9-B4(VBUS)
GND: C5.1 C6.1 C7.1 C8.1 D1.2 D2.2 D3.2 J2.A1-B12(GND) J2.A12-B1(GND) R7.1 R8.1 U3.4(GND) U3.17(GND) U3.20(GND) U3.24(AGND) U3.33(EP)
DBGU_RX: U3.30(TXD)
DBGU_TX: U3.2(RXD)
SMARC_GPIO11: R9.2 U3.18(RESET_N)
USB_DEBUG_D_N: D1.1 J2.A7(Dn1) J2.B7(Dn2) U3.15(USBDM)
USB_DEBUG_D_P: D2.1 J2.A6(Dp1) J2.B6(Dp2) U3.14(USBDP)
NetJ2_A5: J2.A5(CC1) R8.2
NetJ2_B5: J2.B5(CC2) R7.2
NetLED5_1: LED5.1 R28.1
NetLED5_2: LED5.2 U3.22(GPIO0)
NetLED6_1: LED6.1 R29.1
NetLED6_2: LED6.2 U3.21(GPIO1)

Not connected (* = marked no-connect by the designer): J2 1(MNT)* A8(SBU1)* B8(SBU2)*; U3 3(RI_N)* 5(GPIO5) 6(DSR_N)* 7(DCD_N)* 8(CTS__N)* 9(GPIO4) 10(GPIO2) 11(GPIO3) 12(GPIO6) 13(GPIO7) 23(DNU1)* 25(DNU2)* 26(DNU3)* 27(DNU4)* 28(DNU5)* 29(DNU6)* 31(DTR_N)* 32(RTS_N)*

### Layout directives
differential pair: USB_DEBUG_D_N, USB_DEBUG_D_P

### Library data of the parts
C5 C7 = CAP-0805: Capacitor chip unpolarized. 0805
C6 C8 = CAP-0603: Capacitor chip unpolarized. 0603
D1-D3 = DF2S10FS,L3M: TVS Diode 8VRM
J2 = UJ20-C-H-G-SMT-1-P16-TR: USB-C Conn Surface Mount (16 + 8 Dummy)
R7-R9 R28 R29 = RES-0603: Resistor chip. 0603
U3 = CY7C65213-32LTXI: USB-UART LP Bridge Controller; Manufacturer: Infineon Technologies; Manufacturer Order Number: CY7C65213-32LTXI; PackageReference: QFN-32

## Nets that join several sheets
1V8: MicroSD (9 pins), Power (C15.2 C16.2 U5.5), CAN (C19.2 C20.2 U6.5), Headers (J9.6), Display (5 pins), UART Debug (7 pins)
3V3: MicroSD (14 pins), Power (7 pins), Ethernet (R12.2 R13.2), Headers (J9.4), LEDs (R22.2 R23.2 R24.2), Display (10 pins), UART Debug (C5.2 C6.2 U3.19)
5V: Power (C12.2 C13.2 U4.3), CAN (C17.2 C18.2 U6.3), Headers (J9.2), SMARC Pinout-1 (11 pins), UART Debug (D3.1 J2.A4-B9 J2.A9-B4)
GND: MicroSD (18 pins), Power (10 pins), CAN (7 pins), USB (11 pins), Headers (5 pins), LEDs (6 pins), Display (20 pins), SMARC Pinout-1 (49 pins), UART Debug (16 pins)
CAN0_RX: CAN (U6.1), SMARC Pinout-2 (J3.P144)
CAN0_TX: CAN (U6.4), SMARC Pinout-2 (J3.P143)
DBGU_RX: SMARC Pinout-2 (J3.P137), UART Debug (U3.30)
DBGU_TX: SMARC Pinout-2 (J3.P136), UART Debug (U3.2)
DSIO0_CLK_N: Display (J5.18), SMARC Pinout-1 (J3.S135)
DSIO0_CLK_P: Display (J5.17), SMARC Pinout-1 (J3.S134)
DSIO0_D0_N: Display (J5.21), SMARC Pinout-1 (J3.S126)
DSIO0_D0_P: Display (J5.20), SMARC Pinout-1 (J3.S125)
DSIO0_D1_N: Display (J5.15), SMARC Pinout-1 (J3.S129)
DSIO0_D1_P: Display (J5.14), SMARC Pinout-1 (J3.S128)
DSIO0_D2_N: Display (J5.12), SMARC Pinout-1 (J3.S132)
DSIO0_D2_P: Display (J5.11), SMARC Pinout-1 (J3.S131)
DSIO0_D3_N: Display (J5.24), SMARC Pinout-1 (J3.S138)
DSIO0_D3_P: Display (J5.23), SMARC Pinout-1 (J3.S137)
GBE0_LINK1000#: Ethernet (J4.12), SMARC Pinout-3 (J3.P22)
GBE0_LINK_ACT#: Ethernet (J4.14), SMARC Pinout-3 (J3.P25)
GBE0_TXRX_A_N: Ethernet (J4.2), SMARC Pinout-3 (J3.P29)
GBE0_TXRX_A_P: Ethernet (J4.1), SMARC Pinout-3 (J3.P30)
GBE0_TXRX_B_N: Ethernet (J4.4), SMARC Pinout-3 (J3.P26)
GBE0_TXRX_B_P: Ethernet (J4.3), SMARC Pinout-3 (J3.P27)
GBE0_TXRX_C_N: Ethernet (J4.8), SMARC Pinout-3 (J3.P23)
GBE0_TXRX_C_P: Ethernet (J4.7), SMARC Pinout-3 (J3.P24)
GBE0_TXRX_D_N: Ethernet (J4.10), SMARC Pinout-3 (J3.P19)
GBE0_TXRX_D_P: Ethernet (J4.9), SMARC Pinout-3 (J3.P20)
I2C_PM_SCL: Headers (J9.17), SMARC Pinout-3 (J3.P121)
I2C_PM_SDA: Headers (J9.16), SMARC Pinout-3 (J3.P122)
LCD_BKLT_PWM: Display (U7.4), SMARC Pinout-1 (J3.S141)
LCD_NRST: Display (J5.27 R15.1), SMARC Pinout-3 (J3.P118)
QSPI0_CLK: Headers (J9.32), SMARC Pinout-2 (J3.P56)
QSPI0_CS: Headers (J9.34), SMARC Pinout-2 (J3.P54)
QSPI0_IO0: Headers (J9.28), SMARC Pinout-2 (J3.P58)
QSPI0_IO1: Headers (J9.30), SMARC Pinout-2 (J3.P57)
QSPI0_IO2: Headers (J9.25), SMARC Pinout-2 (J3.S56)
QSPI0_IO3: Headers (J9.26), SMARC Pinout-2 (J3.S57)
SER0_CTS: Headers (J9.11), SMARC Pinout-2 (J3.P132)
SER0_RTS: Headers (J9.12), SMARC Pinout-2 (J3.P131)
SER0_RX: Headers (J9.13), SMARC Pinout-2 (J3.P130)
SER0_TX: Headers (J9.14), SMARC Pinout-2 (J3.P129)
SER1_RX: Headers (J9.9), SMARC Pinout-2 (J3.P135)
SER1_TX: Headers (J9.10), SMARC Pinout-2 (J3.P134)
SMARC_GPIO0: Headers (J9.24), SMARC Pinout-2 (J3.P108), SMARC Pinout-3 (J3.P108)
SMARC_GPIO1: Headers (J9.23), SMARC Pinout-2 (J3.P109), SMARC Pinout-3 (J3.P109)
SMARC_GPIO2: Headers (J9.22), SMARC Pinout-2 (J3.P110), SMARC Pinout-3 (J3.P110)
SMARC_GPIO3: Headers (J9.21), SMARC Pinout-2 (J3.P111), SMARC Pinout-3 (J3.P111)
SMARC_GPIO4: Headers (J9.20), SMARC Pinout-2 (J3.P112), SMARC Pinout-3 (J3.P112)
SMARC_GPIO5: Headers (J9.19), SMARC Pinout-3 (J3.P113)
SMARC_GPIO6: Headers (J9.18), SMARC Pinout-3 (J3.P114)
SMARC_GPIO7: LEDs (Q3.1 R27.2), SMARC Pinout-3 (J3.P115)
SMARC_GPIO8: LEDs (Q2.1 R26.2), SMARC Pinout-3 (J3.P116)
SMARC_GPIO9: LEDs (Q1.1 R25.2), SMARC Pinout-3 (J3.P117)
SMARC_GPIO11: SMARC Pinout-3 (J3.P119), UART Debug (R9.2 U3.18)
SMARC_NRST: Headers (J9.15), SMARC Pinout-3 (J3.P127)
SMARC_SDIO_CD#: MicroSD (J1.9 R6.1 U1.3), SMARC Pinout-2 (J3.P35)
SMARC_SDIO_CK: MicroSD (U8.9), SMARC Pinout-2 (J3.P36)
SMARC_SDIO_CMD: MicroSD (R21.1 U8.4), SMARC Pinout-2 (J3.P34)
SMARC_SDIO_D0: MicroSD (R20.1 U8.6), SMARC Pinout-2 (J3.P39)
SMARC_SDIO_D1: MicroSD (R19.1 U8.7), SMARC Pinout-2 (J3.P40)
SMARC_SDIO_D2: MicroSD (R18.1 U8.1), SMARC Pinout-2 (J3.P41)
SMARC_SDIO_D3: MicroSD (R11.1 U8.3), SMARC Pinout-2 (J3.P42)
SPI0_CLK: Headers (J9.29), SMARC Pinout-2 (J3.P44)
SPI0_CS: Headers (J9.27), SMARC Pinout-2 (J3.P43)
SPI0_MISO: Headers (J9.31), SMARC Pinout-2 (J3.P45)
SPI0_MOSI: Headers (J9.33), SMARC Pinout-2 (J3.P46)
USB0_D_N: USB (D9.1 J7.2B), SMARC Pinout-2 (J3.P61)
USB0_D_P: USB (D10.1 J7.3B), SMARC Pinout-2 (J3.P60)
USB1_D_N: USB (D5.1 J7.2A), SMARC Pinout-2 (J3.P66)
USB1_D_P: USB (D6.1 J7.3A), SMARC Pinout-2 (J3.P65)
USB2_D_N: USB (D7.1 J8.2), SMARC Pinout-2 (J3.P70)
USB2_D_P: USB (D8.1 J8.3), SMARC Pinout-2 (J3.P69)